# Altium schematic sheet DE-230724.SchDoc: Zaštita od vjetra
size A4; Author: eldar6776@hotmail.com; DrawnBy: Eldar Dedić; Organization: JUBERA d.o.o.; Address1: Braće Mulić 81; Address2: 71000 Sarajevo; Address3: Federacija BiH; Address4: Bosna i Hercegovina; DocumentNumber: DE-230724; Revision: 001; SheetNumber: 1; SheetTotal: 1
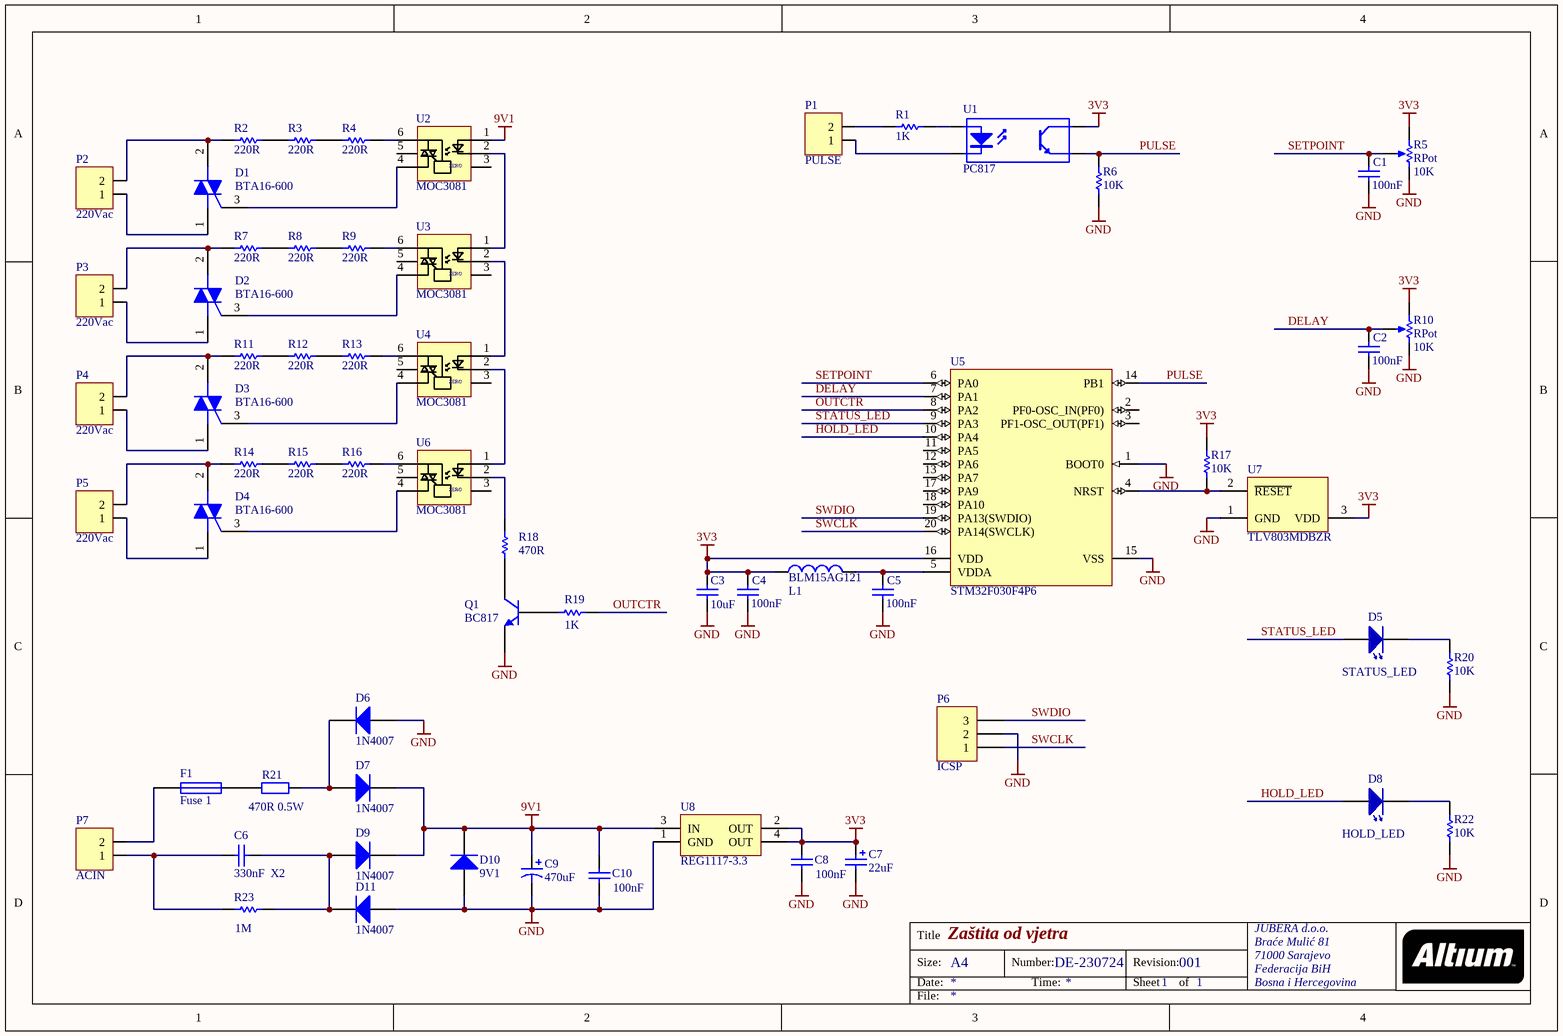
[diagram p0: DE-230724.SchDoc]

## Parts
C1  value 100nF  [0603]  (hidden comment: C0603)
C2  value 100nF  [0603]  (hidden comment: C0603)
C3  value 10uF  [0805]  (hidden comment: C0805)
C4  value 100nF  [0603]  (hidden comment: C0603)
C5  value 100nF  [0603]  (hidden comment: C0603)
C6  330nF  X2  [0,33uF X2]
C7  22uF  [CAPPR2-5X11]
C8  value 100nF  [0603]  (hidden comment: C0603)
C9  470uF  [CAPPR5-10X12.5]
C10  value 100nF  [0603]  (hidden comment: C0603)
D1  BTA16-600  [ONSC-TO-220-3-221A-07]
D2  BTA16-600  [ONSC-TO-220-3-221A-07]
D3  BTA16-600  [ONSC-TO-220-3-221A-07]
D4  BTA16-600  [ONSC-TO-220-3-221A-07]
D5  STATUS_LED  [LED 3mm]
D6  1N4007  [SMB]
D7  1N4007  [SMB]
D8  HOLD_LED  [LED 3mm]
D9  1N4007  [SMB]
D10  9V1  [DO-41]
D11  1N4007  [SMB]
F1  Fuse 1  [PIN-W2/E2.8]
L1  BLM15AG121  [0603]
P1  PULSE  [TERMINAL BLOK 2 - 7mm]
P2  220Vac  [TERMINAL BLOK 2 - 3,5mm]
P3  220Vac  [TERMINAL BLOK 2 - 3,5mm]
P4  220Vac  [TERMINAL BLOK 2 - 3,5mm]
P5  220Vac  [TERMINAL BLOK 2 - 3,5mm]
P6  ICSP  [HDR1X3]
P7  ACIN  [TERMINAL BLOK 2 - 7mm]
Q1  BC817  [SOT23_N]
R1  1K  [ERA-0603]
R2  220R  [ERA-0805]
R3  220R  [ERA-0805]
R4  220R  [ERA-0805]
R5  RPot  value 10K  [HDR1X3]
R6  10K  [ERA-0603]
R7  220R  [ERA-0805]
R8  220R  [ERA-0805]
R9  220R  [ERA-0805]
R10  RPot  value 10K  [HDR1X3]
R11  220R  [ERA-0805]
R12  220R  [ERA-0805]
R13  220R  [ERA-0805]
R14  220R  [ERA-0805]
R15  220R  [ERA-0805]
R16  220R  [ERA-0805]
R17  10K  [ERA-0603]
R18  470R  [ERA-0603]
R19  1K  [ERA-0603]
R20  10K  [ERA-0603]
R21  value 470R 0.5W  [AXIAL-0.4]  (hidden comment: Res2)
R22  10K  [ERA-0603]
R23  value 1M  [AXIAL-0.3]  (hidden comment: Res1)
U1  PC817  [DIP-4]
U2  MOC3081  [DIP6]
U3  MOC3081  [DIP6]
U4  MOC3081  [DIP6]
U5  STM32F030F4P6  [STM-TSSOP20_N]
U6  MOC3081  [DIP6]
U7  TLV803MDBZR  [DBZ3_N]
U8  REG1117-3.3  [ZZ311]

## Nets
3V3: C3.2 C4.2 C7.1 C8.2 L1.1 R5.1(TOP) R10.1(TOP) R17.2 U1.4(C) U5.16(VDD) U7.3(VDD) U8.2(OUT) U8.4(OUT)
9V1: C9.1 C10.2 D7.2(K) D9.2(K) D10.2(K) U2.1 U8.3(IN)
GND: C1.1 C2.1 C3.1 C4.1 C5.1 C7.2 C8.1 C9.2 C10.1 D6.1(A) D10.1(A) D11.1(A) P6.2 Q1.2(E) R5.2(BOT) R6.2 R10.2(BOT) R20.2 R22.2 U5.1(BOOT0) U5.15(VSS) U7.1(GND) U8.1(GND)
DELAY: C2.2 R10.3(TAP) U5.7(PA1)
HOLD_LED: D8.2 U5.10(PA4)
OUTCTR: R19.1 U5.8(PA2)
PULSE: R6.1 U1.3(E) U5.14(PB1)
SETPOINT: C1.2 R5.3(TAP) U5.6(PA0)
STATUS_LED: D5.2 U5.9(PA3)
SWCLK: P6.1 U5.20(PA14(SWCLK))
SWDIO: P6.3 U5.19(PA13(SWDIO))
NetC5_2: C5.2 L1.2 U5.5(VDDA)
NetC6_1: C6.1 P7.1 R23.1
NetC6_2: C6.2 D9.1(A) D11.2(K) R23.2
NetD1_1: D1.1(MT1) P2.1
NetD1_2: D1.2(MT2) P2.2 R2.1
NetD1_3: D1.3(G) U2.4
NetD2_1: D2.1(MT1) P3.1
NetD2_2: D2.2(MT2) P3.2 R7.1
NetD2_3: D2.3(G) U3.4
NetD3_1: D3.1(MT1) P4.1
NetD3_2: D3.2(MT2) P4.2 R11.1
NetD3_3: D3.3(G) U4.4
NetD4_1: D4.1(MT1) P5.1
NetD4_2: D4.2(MT2) P5.2 R14.1
NetD4_3: D4.3(G) U6.4
NetD5_1: D5.1 R20.1
NetD6_2: D6.2(K) D7.1(A) R21.2
NetD8_1: D8.1 R22.1
NetF1_1: F1.1 P7.2
NetF1_2: F1.2 R21.1
NetP1_1: P1.1 U1.2(K)
NetP1_2: P1.2 R1.1
NetQ1_1: Q1.1(B) R19.2
NetQ1_3: Q1.3(C) R18.1
NetR1_2: R1.2 U1.1(A)
NetR2_2: R2.2 R3.1
NetR3_2: R3.2 R4.1
NetR4_2: R4.2 U2.6
NetR7_2: R7.2 R8.1
NetR8_2: R8.2 R9.1
NetR9_2: R9.2 U3.6
NetR11_2: R11.2 R12.1
NetR12_2: R12.2 R13.1
NetR13_2: R13.2 U4.6
NetR14_2: R14.2 R15.1
NetR15_2: R15.2 R16.1
NetR16_2: R16.2 U6.6
NetR17_1: R17.1 U5.4(NRST) U7.2(~{RESET})
NetR18_2: R18.2 U6.2
NetU2_2: U2.2 U3.1
NetU3_2: U3.2 U4.1
NetU4_2: U4.2 U6.1

Not connected (* = marked no-connect by the designer): U2 3 5; U3 3 5; U4 3 5; U5 2(PF0-OSC_IN(PF0)) 3(PF1-OSC_OUT(PF1)) 11(PA5) 12(PA6) 13(PA7) 17(PA9) 18(PA10); U6 3 5

## Notes on the sheet
- Title
- Size:
- Date:
- A4
- Number:
- Time:
- Revision:
- Sheet
- of
- File:
- (in symbol MOC3081) ZERO

## Library data of the parts
C1 C2 C4 C5 = C0603: Ceramic Chip Capacitor - 25V; Note: Footprint corresponds to dimensions for bulk cassette packaging. This case size has tightened tolerances.; Published: 17-Jul-2002; LatestRevisionDate: 19-Mar-2004; LatestRevisionNote: Silkscreen size reduced.; DatasheetDocument: Mar-2001; PackageDocument: Mar-2001; PackageReference: 0603; Publisher: Altium Limited; Code_JEITA: 0603; Code_IPC: 1608 [0603]; ComponentLink1Description: Manufacturer Link; ComponentLink1URL: http://www.kemet.com/; ComponentLink2Description: Datasheet; ComponentLink2URL: http://www.kemet.com/kemet/web/homepage/kechome.nsf/vapubfilesname/F3102TA.pdf/$file/F3102TA.pdf
C3 = C0805: Ceramic Chip Capacitor - 25V; Note: Footprint corresponds to dimensions for bulk cassette packaging. This case size has tightened tolerances.; Published: 17-Jul-2002; LatestRevisionDate: 19-Mar-2004; LatestRevisionNote: Silkscreen size reduced.; DatasheetDocument: Mar-2001; PackageDocument: Mar-2001; PackageReference: 0805; Publisher: Altium Limited; Code_JEITA: 0805; Code_IPC: 2012[0805]; ComponentLink1Description: Manufacturer Link; ComponentLink1URL: http://www.kemet.com/; ComponentLink2Description: Datasheet; ComponentLink2URL: http://www.kemet.com/kemet/web/homepage/kechome.nsf/vapubfilesname/F3102TA.pdf/$file/F3102TA.pdf
C6 = 0,33uF X2: Dipped Radial Multilayer Ceramic Capacitor COG (NPO): 330nF 275VAC X2; Value: 100nF; Published: 17-Dec-2003; LatestRevisionDate: 19-Mar-2004; LatestRevisionNote: PCB Footprint - Drill hole diameter reduced.; DatasheetDocument: 2-Jan-2002; PackageDocument: 2-Jan-2002; PackageReference: VP60-3.6; Publisher: Altium Limited; ComponentLink1Description: Manufacturer Link; ComponentLink1URL: http://www.vishay.com/
C7 = EKA00AA247F00: Aluminum Electrolytic Capacitor, Radial Style with Long Leads: 47uF, 35V; Note: Refer to Manufacturer's Data Sheets for other lead formations; DrillSize: Nominal, Rounded To The Nearest 0.1mm; Published: 19-Mar-2004; DatasheetDocument: 20-Feb-2001; PackageReference: CAPPR2-5X11; Publisher: Altium Limited; ComponentLink1Description: Manufacturer Link; ComponentLink1URL: http://www.vishay.com/; ComponentLink2Description: Datasheet; ComponentLink2URL: http://www.vishay.com/docs/25014/eka.pdf; Value: 47uF
C8 C10 = C0603: Ceramic Chip Capacitor - Standard; Note: Footprint corresponds to dimensions for bulk cassette packaging. This case size has tightened tolerances.; Published: 17-Jul-2002; LatestRevisionDate: 19-Mar-2004; LatestRevisionNote: Silkscreen size reduced.; DatasheetDocument: Mar-2001; PackageDocument: Mar-2001; PackageReference: 0603; Publisher: Altium Limited; Code_JEITA: 0603; Code_IPC: 1608 [0603]; ComponentLink1Description: Manufacturer Link; ComponentLink1URL: http://www.kemet.com/; ComponentLink2Description: Datasheet; ComponentLink2URL: http://www.kemet.com/kemet/web/homepage/kechome.nsf/vapubfilesname/F3102TA.pdf/$file/F3102TA.pdf
C9 = EKA00DC347E00: Aluminum Electrolytic Capacitor, Radial Style with Long Leads: 470uF, 25V; Note: Refer to Manufacturer's Data Sheets for other lead formations; DrillSize: Nominal, Rounded To The Nearest 0.1mm; Published: 19-Mar-2004; DatasheetDocument: 20-Feb-2001; PackageReference: CAPPR5-10X12.5; Publisher: Altium Limited; ComponentLink1Description: Manufacturer Link; ComponentLink1URL: http://www.vishay.com/; ComponentLink2Description: Datasheet; ComponentLink2URL: http://www.vishay.com/docs/25014/eka.pdf; Value: 470uF
D1-D4 = BTA08-600BW3G: Triacs, Silicon Bidirectional Thyristor, 3-Pin TO-220, Pb-Free, Tube; Manufacturer: On Semiconductor; IGT Max (mA): 50; IT(RMS) Max (A): 8; ITSM Max (A): 90; DatasheetVersion: Rev. 1; PackageVersion: Rev. O, 07/2008; PackageReference: TO-220-3-221A-07; PackageDescription: 3-Pin Flange Mount, Vertical Straight Lead, Body 9.97 x 4.445 mm, Pitch 2.54 mm; Supplier 1: Digi-Key; Supplier Part Number 1: BTA08-600BW3G-ND; Supplier 2: Newark; Supplier Part Number 2: 13P2072; Supplier 3: Mouser; Supplier Part Number 3: 863-BTA08-600BW3G; Packing: Tube; RoHS: Pb-Free; Mounting Technology: Through Hole; PartNumber: BTA08-600BW3G; ComponentLink1Description: Manufacturer URL; ComponentLink1URL: http://www.onsemi.com/; ComponentLink2Description: Datasheet; ComponentLink2URL: http://www.onsemi.com/pub_link/Collateral/BTA08-600BW3-D.PDF; ComponentLink3Description: Package Specification; ComponentLink3URL: http://www.onsemi.com/pub_link/Collateral/221A-07.PDF
D5 D8 = LED 3mm
D6 D7 D9 D11 = Diode 1N4007: 1 Amp General Purpose Rectifier; Published: 8-Jun-2000; LatestRevisionDate: 17-Jul-2002; LatestRevisionNote: Re-released for DXP Platform.; DatasheetVersion: 1998; PackageVersion: Aug-1999; PackageReference: DO-41; Publisher: Altium Limited; PackageDescription: Diode, Axial; Body 5.2 x 2.7 mm (LxDia. max), Lead Dia. 0.86 mm (max); Code_JEDEC: DO-204-AL; ComponentLink1Description: Manufacturer Link; ComponentLink1URL: http://www.fairchildsemi.com/; ComponentLink2Description: Datasheet; ComponentLink2URL: http://www.fairchildsemi.com/ds/1N%2F1N4001.pdf
D10 = Diode 1N914: High Conductance Fast Diode; Published: 8-Jun-2000; LatestRevisionDate: 17-Jul-2002; LatestRevisionNote: Re-released for DXP Platform.; DatasheetVersion: 1997; PackageReference: DO-35; Publisher: Altium Limited; PackageDescription: Diode, Axial; Body 3.8 x 1.9 mm (LxDia. max), Lead Dia. 0.53 mm (max); Code_JEDEC: DO-204-AH; ComponentLink1Description: Manufacturer Link; ComponentLink1URL: http://www.fairchildsemi.com/; ComponentLink2Description: Datasheet; ComponentLink2URL: http://www.fairchildsemi.com/ds/1N%2F1N4448.pdf
F1 = Fuse 1: Fuse; Published: 8-Jun-2000; LatestRevisionDate: 17-Jul-2002; LatestRevisionNote: Re-released for DXP Platform.; PackageReference: PIN-W2/E2.8; Publisher: Altium Limited; PackageDescription: Thru-Hole; 2 Leads
L1 = Inductor_SMD: Inductor; Code_IEC: 1005; Published: 8-Jun-2000; LatestRevisionDate: 29-May-2009; LatestRevisionNote: IPC-7351 Footprint Added.; PackageReference: 0402-A; Publisher: Altium Limited; PackageDescription: Chip Inductor; Code_JEITA: 0402
P1-P5 P7 = TERMINAL BLOK 2: Terminal blok konektor 3,5 mm
P6 = Header 3: Header, 3-Pin; LatestRevisionDate: 17-Jul-2002; LatestRevisionNote: Re-released for DXP Platform.; Publisher: Altium Limited
Q1 = BC817: NPN General-purpose Transistor; Published: 17-Sep-2003; LatestRevisionDate: 12-Dec-2006; LatestRevisionNote: IPC-7351 Footprint Added.; DatasheetVersion: Jun-1999; PackageVersion: May-1999; PackageReference: SOT23; Publisher: Altium Limited; PackageDescription: 3-Pin SOT-23 Package 0.95 mm Pitch, 2.3 mm Lead Span; ComponentLink1Description: Manufacturer Link; ComponentLink1URL: http://www.semiconductors.philips.com/; ComponentLink2Description: Datasheet; ComponentLink2URL: http://www.semiconductors.philips.com/acrobat/datasheets/BC817_BC817W_BC337_5.pdf
R1 R6 R17-R20 R22 = ERAV: Metal Film Thermosensitive Chip Resistor, 0.56 Ohm to 10k Ohm Range, 5% Tolerance, 0603 Size, 0.063 W; Note: If flow soldering, adjust pad width of PCB Footprint to 0.7 - 0.8 times the width of the resistor.; Published: 17-Dec-2003; LatestRevisionDate: 19-Mar-2004; LatestRevisionNote: Silkscreen size reduced.; PackageDocument: Mar-2003; PackageReference: ERA-0603; Publisher: Altium Limited; Code_IPC: 1608 [0603]; ComponentLink1Description: Manufacturer Link; ComponentLink1URL: http://www.panasonic.com/industrial/components/resistive_products.htm; ComponentLink2Description: Datasheet; ComponentLink2URL: http://www.panasonic.com/industrial/components/pdf/AOF0000CE1.pdf
R2-R4 R7-R9 R11-R16 = ERAS: Metal Film Thermosensitive Chip Resistor, 0.56 Ohm to 10k Ohm Range, 5% Tolerance, 0805 Size, 0.1 W; Note: If flow soldering, adjust pad width of PCB Footprint to 0.7 - 0.8 times the width of the resistor.; Published: 17-Dec-2003; LatestRevisionDate: 19-Mar-2004; LatestRevisionNote: Silkscreen size reduced.; PackageDocument: Mar-2003; PackageReference: ERA-0805; Publisher: Altium Limited; Code_IPC: 2012 [0805]; ComponentLink1Description: Manufacturer Link; ComponentLink1URL: http://www.panasonic.com/industrial/components/resistive_products.htm; ComponentLink2Description: Datasheet; ComponentLink2URL: http://www.panasonic.com/industrial/components/pdf/AOF0000CE1.pdf
R5 R10 = RPot: Potentiometer; Sim Note: Enter the Resistance value and the set point into parameter fields.; Set Position: 0.5; Published: 8-Jun-2000; LatestRevisionDate: 17-Jul-2002; LatestRevisionNote: Re-released for DXP Platform.; PackageReference: VR5; Publisher: Altium Limited; PackageDescription: Variable Resistor, Thru-Hole; 3 Leads
R21 = Res2: Resistor; Published: 8-Jun-2000; LatestRevisionDate: 17-Jul-2002; LatestRevisionNote: Re-released for DXP Platform.; PackageReference: AXIAL-0.4; Publisher: Altium Limited; PackageDescription: Axial Device, Thru-Hole; 2 Leads; 0.4 in Pin Spacing
R23 = Res1: Resistor; Published: 8-Jun-2000; LatestRevisionDate: 17-Jul-2002; LatestRevisionNote: Re-released for DXP Platform.; PackageReference: AXIAL-0.3; Publisher: Altium Limited; PackageDescription: Axial Device, Thru-Hole; 2 Leads; 0.3 in Pin Spacing
U1 = PC817: 4-Pin Phototransistor Optocoupler; Published: 24-Mar-1999; LatestRevisionDate: 04-Mar-2005; LatestRevisionNote: Sch pins 3 & 4 Swapped.; DatasheetVersion: Nov-2003; PackageReference: DIP-4; Publisher: Altium Limited
U2-U4 U6 = MOC3081: Zero-Cross Optoisolator Triac Driver
U5 = STM32F030F4P6: ARM Cortex-M0 32-bit MCU, 16 KB Flash, 4 KB Internal RAM, 15 I/Os, 20-pin TSSOP, -40 to 85 degC, Tube; FLASH Size (Prog) (kB): 16; I/Os (High Current): 15; Internal RAM Size (kB): 4; Operating Frequency(F) (Processor speed) (MHz): 48; Supply Voltage(Vcc) min (V): 2.4; DatasheetVersion: Rev. 1; PackageVersion: Rev. 1, 11/2012; PackageReference: TSSOP20; PackageDescription: 20-Pin Thin Shrink Small Outline Package, 6.5 x 4.4 mm Body, 0.65 mm Pitch; Supplier 1: Digi-Key; Supplier Part Number 1: 497-14044-5-ND; Supplier 2: Newark; Supplier Part Number 2: 06X3648; Supplier 3: Mouser; Supplier Part Number 3: 511-STM32F030F4P6; Core: ARM Cortex-M0; Packing: Tube; Mounting Technology: Surface Mount; PartNumber: STM32F030F4P6; ComponentLink1Description: Manufacturer URL; ComponentLink1URL: http://www.st.com/web/en/home.html; ComponentLink2Description: Datasheet; ComponentLink2URL: http://www.st.com/st-web-ui/static/active/en/resource/technical/document/datasheet/DM00088500.pdf; ComponentLink3Description: Package Specification; ComponentLink3URL: http://www.st.com/st-web-ui/static/active/en/resource/technical/document/datasheet/DM00065136.pdf
U7 = TLV803MDBZR: Voltage Supervisor with Active-Low, Open Drain Reset, 1 Supply Monitored, -40 to 125 degC, 3-pin SOT-23 (DBZ), Green (RoHS & no Sb/Br); Manufacturer: Texas Instruments; # of supplies monitored: 1; Iq(Typ)(uA): 9; Output Driver Type / Reset Output: Active-low, Open-drain; Rating: Catalog; Reset Threshold Accuracy(%): 2; SubFamily: Supervisor and Reset IC; Threshold Voltage 1 (typ)(Typ)(V): 4.38; Time Delay(ms): 200; VCC(Max)(V): 6; VCC(Min)(V): 1.1; DatasheetVersion: SBVS157B; PackageVersion: revB, Apr-2005; PackageReference: DBZ3; PackageDescription: 3-Pin Plastic Small-Outline Package, 0.95 mm Pitch, 2.4 mm Lead Span; Supplier 1: Digi-Key; Supplier Part Number 1: 296-29194-2-ND; Supplier 2: Digi-Key; Supplier Part Number 2: 296-29194-1-ND; Supplier 3: Digi-Key; Supplier Part Number 3: 296-29194-6-ND; Supplier 4: Newark; Supplier Part Number 4: 58T0286; Supplier 5: Mouser; Supplier Part Number 5: 595-TLV803MDBZR; Mounting Technology: Surface Mount; Code_JEDEC: TO-236-AB; PartNumber: TLV803MDBZR; ComponentLink1Description: Datasheet; ComponentLink1URL: http://www.ti.com/general/docs/lit/getliterature.tsp?genericPartNumber=TLV803M&fileType=pdf
U8 = REG1117-3.3: 800mA and 1A Low Dropout Positive Regulator 2.85V, 3.3V, 5V, and Adjustable; Published: 8-Jun-2000; LatestRevisionDate: 17-Jul-2002; LatestRevisionNote: Re-released for DXP Platform.; DatasheetVersion: Sep-1997; PackageVersion: revC; PackageReference: ZZ311; Publisher: Altium Limited; PackageDescription: SOT-223/SC-73; 4 Leads; Body 6.7 x 7.3 mm, inc. leads (LxW max); ComponentLink1Description: Manufacturer Link; ComponentLink1URL: http://www.ti.com/; ComponentLink2Description: Datasheet; ComponentLink2URL: http://www-s.ti.com/sc/ds/REG1117.pdf